# Altium schematic sheet PH10EA2332-1.SchDoc
size A4
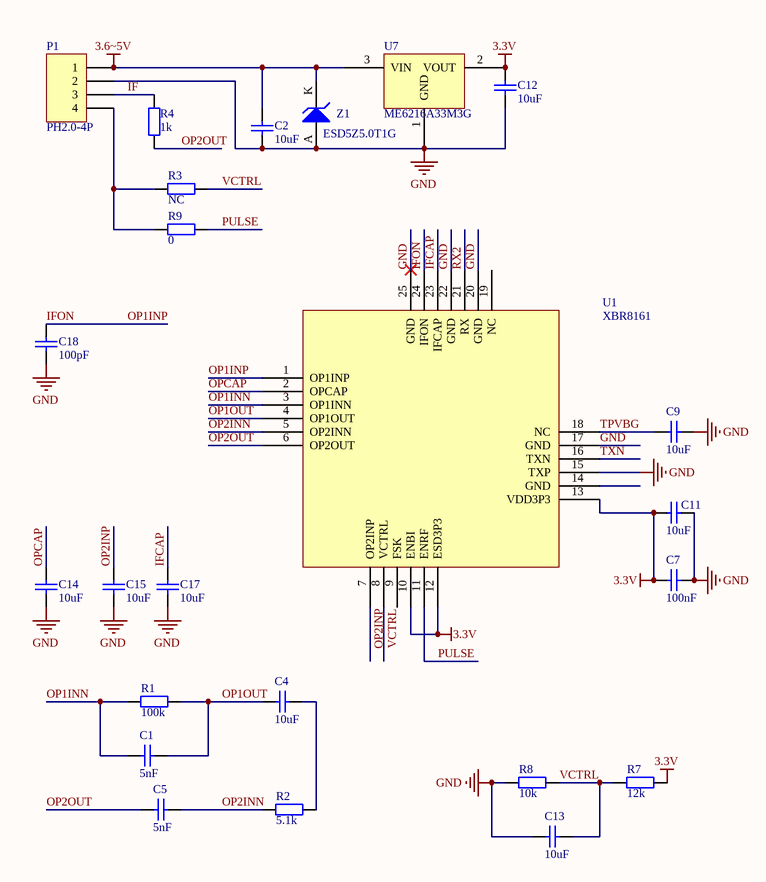
[diagram p0: PH10EA2332-1.SchDoc]

## Parts
C1  5nF  [C0402]
C2  10uF  [C0402]
C4  10uF  [C0402]
C5  5nF  [C0402]
C7  100nF  [C0402]
C9  10uF  [C0402]
C11  10uF  [C0402]
C12  10uF  [C0402]
C13  10uF  [C0402]
C14  10uF  [C0402]
C15  10uF  [C0402]
C17  10uF  [C0402]
C18  100pF  [C0402]
P1  PH2.0-4P  [PH2.0-4P]
R1  100k  [R0402]
R2  5.1k  [R0402]
R3  NC  [R0402]
R4  1k  [R0402]
R7  12k  [R0402]
R8  10k  [R0402]
R9  0  [R0402]
U1  XBR8161  [QFN24]
U7  ME6216A33M3G  [SOT-23-L]
Z1  ESD5Z5.0T1G  [SOD-523]

## Nets
3.3V: C7.2 C11.2 C12.1 R7.1 U1.10(ENBI) U1.12(ESD3P3) U1.13(VDD3P3) U7.2(VOUT)
3.6~5V: C2.1 P1.1 U7.3(VIN) Z1.K
GND: C2.2 C7.1 C9.1 C11.1 C12.2 C13.2 C14.1 C15.2 C17.1 C18.1 P1.2 R8.2 U1.15(TXP) U1.17(GND) U1.20(GND) U1.22(GND) U1.25(GND) U7.1(GND) Z1.A
IF: P1.3 R4.1
IFCAP: C17.2 U1.23(IFCAP)
IFON: C18.2 U1.1(OP1INP) U1.24(IFON)  [also labelled OP1INP]
OP1INN: C1.2 R1.1 U1.3(OP1INN)
OP1OUT: C1.1 C4.2 R1.2 U1.4(OP1OUT)
OP2INN: C5.2 R2.2 U1.5(OP2INN)
OP2INP: C15.1 U1.7(OP2INP)
OP2OUT: C5.1 R4.2 U1.6(OP2OUT)
OPCAP: C14.2 U1.2(OPCAP)
PULSE: R9.2 U1.11(ENRF)
RX2: U1.21(RX)
TPVBG: C9.2 U1.18(NC)
TXN: U1.16(TXN)
VCTRL: C13.1 R3.1 R7.2 R8.1 U1.8(VCTRL)
NetC4_1: C4.1 R2.1
NetP1_4: P1.4 R3.2 R9.1

Not connected (* = marked no-connect by the designer): U1 9(FSK) 14(GND) 19(NC)

## Library data of the parts
C1 C2 C4 C5 C7 C9 C11-C15 C17 C18 = Cap: Capacitor; Published: 8-Jun-2000; LatestRevisionDate: 17-Jul-2002; LatestRevisionNote: Re-released for DXP Platform.; PackageReference: RAD-0.3; Publisher: Altium Limited; PackageDescription: Radial Cap, Thru-Hole; 2 Leads; 0.3 in Pin Spacing
  C1 C5: Value: 5nF
  C2 C4 C9 C11-C15 C17: Value: 10uF
  C7: Value: 100nF
  C18: Value: 100pF
P1 = Header 4: Header, 4-Pin; LatestRevisionDate: 17-Jul-2002; LatestRevisionNote: Re-released for DXP Platform.; Publisher: Altium Limited
R1-R4 R7-R9 = Res2: Resistor; Published: 8-Jun-2000; LatestRevisionDate: 17-Jul-2002; LatestRevisionNote: Re-released for DXP Platform.; PackageReference: AXIAL-0.4; Publisher: Altium Limited; PackageDescription: Axial Device, Thru-Hole; 2 Leads; 0.4 in Pin Spacing
  R1: Value: 100k
  R2: Value: 5.1k
  R3: Value: NC
  R4: Value: 1k
  R7: Value: 12k
  R8: Value: 10k
  R9: Value: 0
U7 = SSP6206
Z1 = D Zener: Zener Diode; Published: 8-Jun-2000; LatestRevisionDate: 17-Jul-2002; LatestRevisionNote: Re-released for DXP Platform.; PackageReference: DIODE-0.7; Publisher: Altium Limited; PackageDescription: Diode, Thru-Hole; 2 Leads; 0.7 in Pin Spacing